# EasyEDA Pro project ProPrj_基于STM32的多功能串口分析仪_2025-03-12.epro, board PCB5
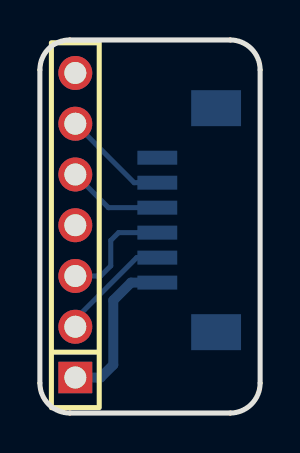
[diagram p13: board, top side]
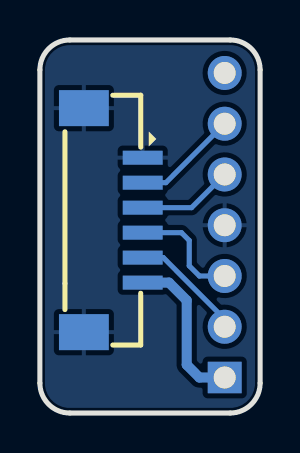
[diagram p14: board, bottom side, seen from below]

Outline 11.05 x 18.67 mm; copper layers: Top Layer, Bottom Layer. Coordinates in mm from the lower left corner of the outline.
Outline path: 0,17.17 0,1.5 arc(0.44,0.44) 1.5,0 9.55,0 arc(10.61,0.44) 11.05,1.5 11.05,17.17 arc(10.61,18.23) 9.55,18.67 1.5,18.67 arc(0.44,18.23) 0,17.17
Stack: Top Layer 0.035mm / Dielectric1 1.51mm FR4 er 4.5 / Bottom Layer 0.035mm

## Design rules (mm)
template: JLCPCB Capability(Two Layers Board)
spacing copperThickness1oz (default): track to track 0.102, other pairs 0.152 to 0.3
spacing copperThickness2oz: track to track 0.203, other pairs 0.152 to 0.3
track width copperThickness1oz (default): min 0.127, default 0.254, max 2.54
track width copperThickness2oz: min 0.203, default 0.254, max 2.54
differential pair differentialPair (default): width min 0.127, default 0.254, max 2.54; gap min 0.152, default 0.152
via viaSize (default): diameter min 0.5, default 0.61, max 10; hole min 0.3, default 0.305, max 6.3

## Placement (name value [footprint] x y rotation side)
CN1  ZX-MX1.25-6PLT  [CONN-SMD_6P-P1.25_ZX-MX1.25-6PLT]  7.37 9.65 270 bottom
H3  -  [HDR-TH_7P-P2.54-V-F]  1.78 9.4 90 top

## Footprints (pads in the part's own frame, mm; a bottom-side part is the same pattern mirrored in y, then rotated)
CONN-SMD_6P-P1.25_ZX-MX1.25-6PLT
  rect 0.7x2 smd: 1(-3.125,1.475) 2(-1.875,1.475) 3(-0.625,1.475) 4(0.625,1.475) 5(1.875,1.475) 6(3.125,1.475)
  rect 1.8x2.5 smd: 7(-5.605,-1.475) 8(5.605,-1.475)
HDR-TH_7P-P2.54-V-F
  rect 1.575x1.7 hole 1.1: 1(-7.62,0)
  round 1.7 hole 1.1: 2(-5.08,0) 3(-2.54,0) 4(0,0) 5(2.54,0) 6(5.08,0) 7(7.62,0)

## Nets
As in the schematic.

## Routing (per net, layer and track width the routed paths; a pad name or vN(x,y) marks a point on that pad's centre or on a via; arc(x,y) is an arc through that point)
M3.3V: length 8
  Bottom Layer w0.5: CN1.6 4.57,6.53 3.68,5.64 3.68,2.41 3.05,1.78 H3.1
RX: length 4.8
  Bottom Layer w0.254: CN1.3 3.44,10.28 1.78,11.94
SWCLK: length 5.8
  Bottom Layer w0.254: CN1.4 3.95,9.03 3.56,8.64 3.56,7.37 3.05,6.86 H3.3
SWDIO: length 5.8
  Bottom Layer w0.254: H3.2 1.78,4.7 4.86,7.78 CN1.5
TX: length 5.3
  Bottom Layer w0.254: CN1.2 4.73,11.53 H3.6

## Copper pours and planes (outline as drawn; the poured copper is in the pictures)
GND on Bottom Layer: -0.13,18.92 11.43,18.92 11.43,-0.38 -0.13,-0.38
